# Altium schematic sheet Microphone.SchDoc: SIM868 Development Board
size 199 x 149 mm; SheetNumber: 8; SheetTotal: 14
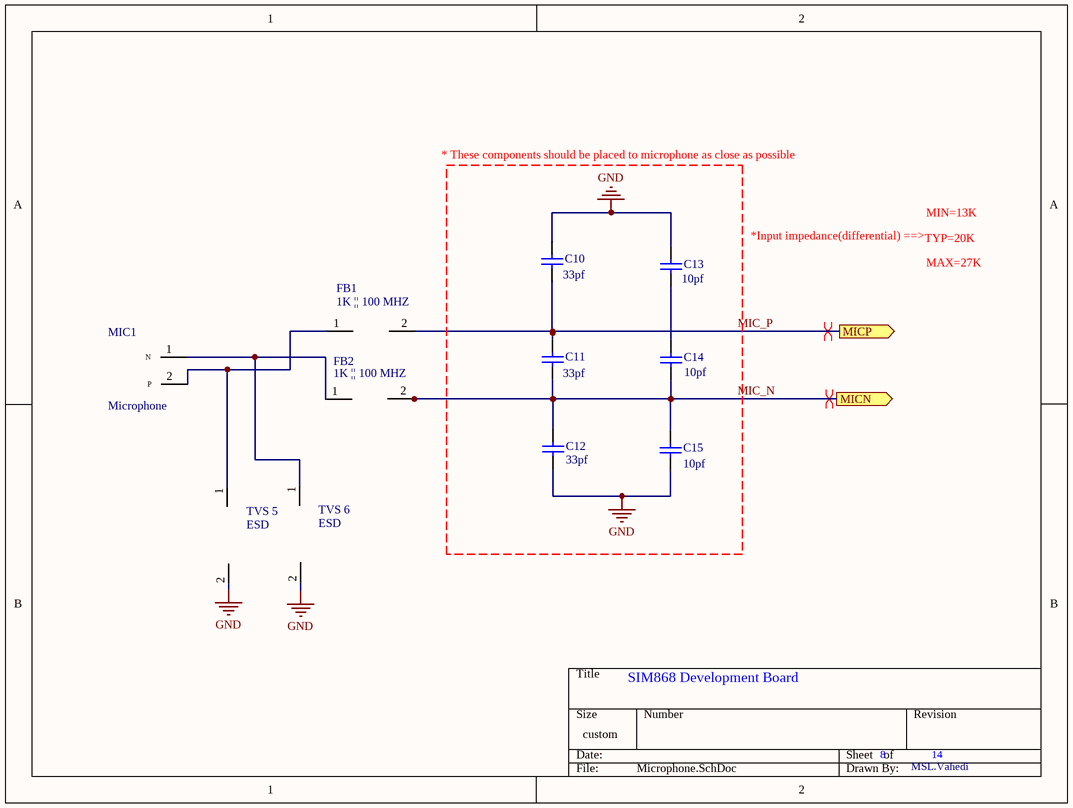
[diagram p0: Microphone.SchDoc]

## Parts
C10  value 33pf  [CAP0805]
C11  value 33pf  [CAP0805]
C12  value 33pf  [CAP0805]
C13  value 10pf  [CAP0805]
C14  value 10pf  [CAP0805]
C15  value 10pf  [CAP0805]
FB1  1K || 100 MHZ  [RES0805]
FB2  1K || 100 MHZ  [RES0805]
MIC1  Microphone  [MIC]
TVS_5  ESD  [*FB_BLM18PG121SN1D]
TVS_6  ESD  [*FB_BLM18PG121SN1D]

## Ports
MICN (out), MICP (out)

## Nets
GND: C10.1 C12.2 C13.1 C15.2 TVS_5.2 TVS_6.2
MIC_N: C11.2 C12.1 C14.2 C15.1 FB2.2 ; port MICN
MIC_P: C10.2 C11.1 FB1.2 ; port MICP
NetC13_2: C13.2 C14.1
NetFB1_1: FB1.1 MIC1.2(P) TVS_5.1
NetFB2_1: FB2.1 MIC1.1(N) TVS_6.1

## Layout directives
differential pair; differential pair class MICDIFF: MIC_N, MIC_P

## Notes on the sheet
- * These components should be placed to microphone as close as possible
- MIN=13K
- *Input impedance(differential) ==>
- TYP=20K
- MAX=27K
- MSL.Vahedi

## Library data of the parts
C10-C15 = Cap: Capacitor; Published: 8-Jun-2000; LatestRevisionDate: 17-Jul-2002; LatestRevisionNote: Re-released for DXP Platform.; PackageReference: RAD-0.3; Publisher: Altium Limited; PackageDescription: Radial Cap, Thru-Hole; 2 Leads; 0.3 in Pin Spacing
FB1 FB2 = Ferrite bead
TVS_5 TVS_6 = TVS